# EAGLE schematic 16ChFNIRS (EAGLE 9.6.2)
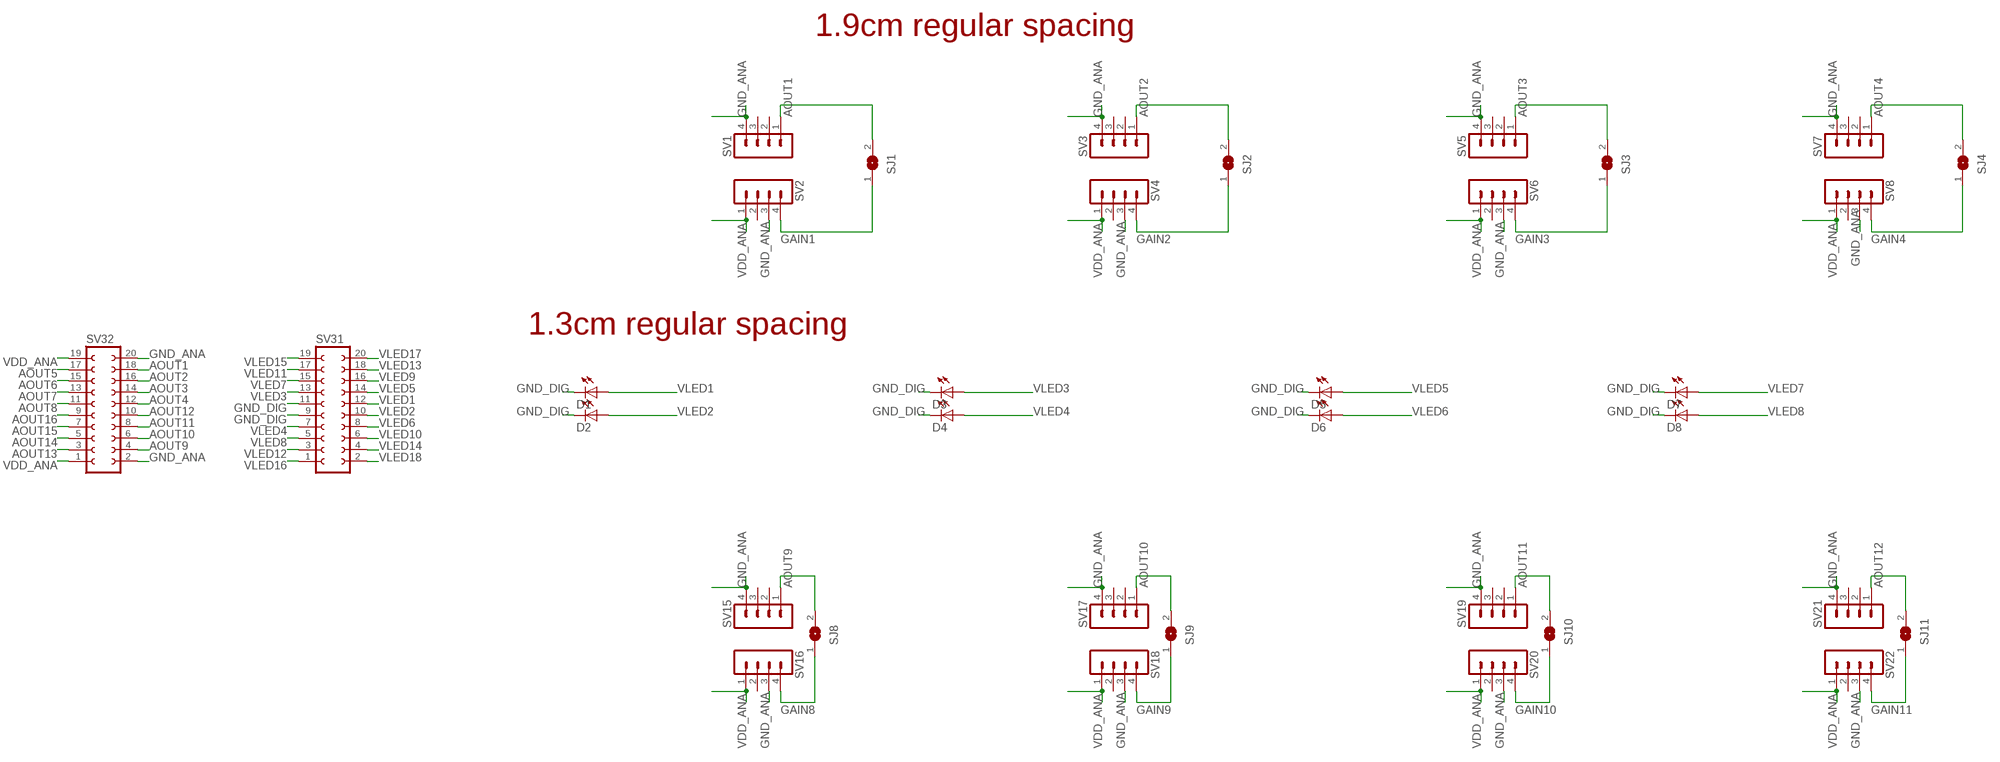
[diagram p0: schematic, sheet 1, part 1 of 2]
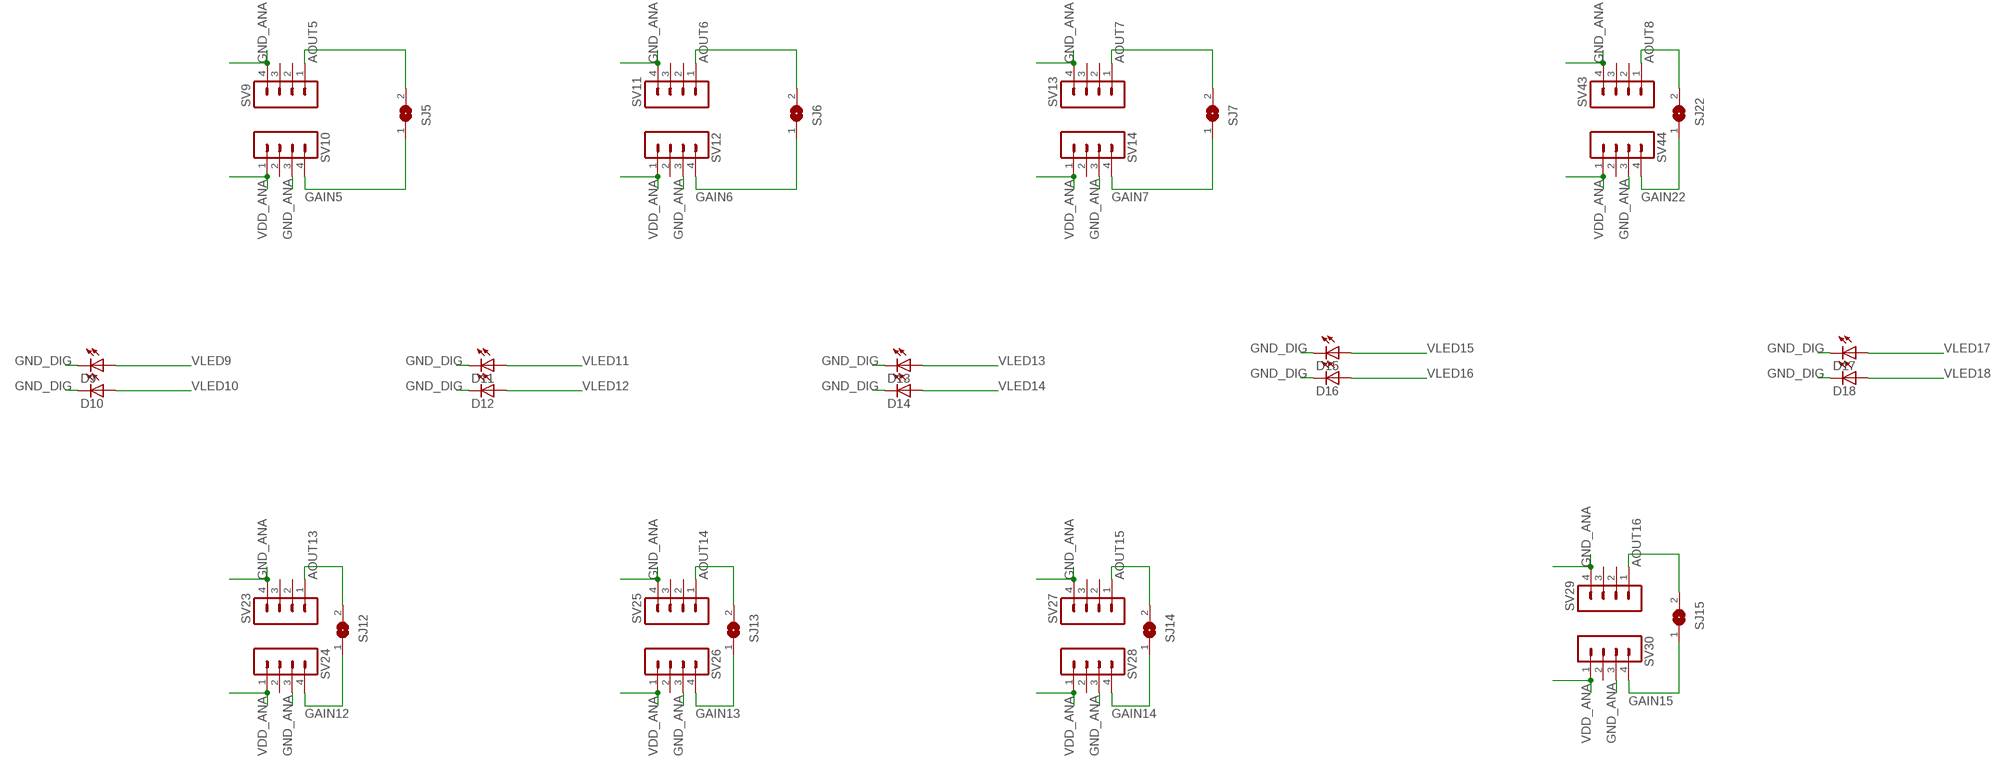
[diagram p1: schematic, sheet 1, part 2 of 2]

## Parts
D1  LED1206  [LED-1206]
D2  LED1206  [LED-1206]
D3  LED1206  [LED-1206]
D4  LED1206  [LED-1206]
D5  LED1206  [LED-1206]
D6  LED1206  [LED-1206]
D7  LED1206  [LED-1206]
D8  LED1206  [LED-1206]
D9  LED1206  [LED-1206]
D10  LED1206  [LED-1206]
D11  LED1206  [LED-1206]
D12  LED1206  [LED-1206]
D13  LED1206  [LED-1206]
D14  LED1206  [LED-1206]
D15  LED1206  [LED-1206]
D16  LED1206  [LED-1206]
D17  LED1206  [LED-1206]
D18  LED1206  [LED-1206]
SJ1  SJ  [SJ]
SJ2  SJ  [SJ]
SJ3  SJ  [SJ]
SJ4  SJ  [SJ]
SJ5  SJ  [SJ]
SJ6  SJ  [SJ]
SJ7  SJ  [SJ]
SJ8  SJ  [SJ]
SJ9  SJ  [SJ]
SJ10  SJ  [SJ]
SJ11  SJ  [SJ]
SJ12  SJ  [SJ]
SJ13  SJ  [SJ]
SJ14  SJ  [SJ]
SJ15  SJ  [SJ]
SJ22  SJ  [SJ]
SV1  MA04-1  [MA04-1]
SV2  MA04-1  [MA04-1]
SV3  MA04-1  [MA04-1]
SV4  MA04-1  [MA04-1]
SV5  MA04-1  [MA04-1]
SV6  MA04-1  [MA04-1]
SV7  MA04-1  [MA04-1]
SV8  MA04-1  [MA04-1]
SV9  MA04-1  [MA04-1]
SV10  MA04-1  [MA04-1]
SV11  MA04-1  [MA04-1]
SV12  MA04-1  [MA04-1]
SV13  MA04-1  [MA04-1]
SV14  MA04-1  [MA04-1]
SV15  MA04-1  [MA04-1]
SV16  MA04-1  [MA04-1]
SV17  MA04-1  [MA04-1]
SV18  MA04-1  [MA04-1]
SV19  MA04-1  [MA04-1]
SV20  MA04-1  [MA04-1]
SV21  MA04-1  [MA04-1]
SV22  MA04-1  [MA04-1]
SV23  MA04-1  [MA04-1]
SV24  MA04-1  [MA04-1]
SV25  MA04-1  [MA04-1]
SV26  MA04-1  [MA04-1]
SV27  MA04-1  [MA04-1]
SV28  MA04-1  [MA04-1]
SV29  MA04-1  [MA04-1]
SV30  MA04-1  [MA04-1]
SV31  FE10-2  [FE10-2]
SV32  FE10-2  [FE10-2]
SV43  MA04-1  [MA04-1]
SV44  MA04-1  [MA04-1]

## Nets
AOUT1: SJ1.2 SV1.1 SV32.18
AOUT2: SJ2.2 SV3.1 SV32.16
AOUT3: SJ3.2 SV5.1 SV32.14
AOUT4: SJ4.2 SV7.1 SV32.12
AOUT5: SJ5.2 SV9.1 SV32.17
AOUT6: SJ6.2 SV11.1 SV32.15
AOUT7: SJ7.2 SV13.1 SV32.13
AOUT8: SJ22.2 SV32.11 SV43.1
AOUT9: SJ8.2 SV15.1 SV32.4
AOUT10: SJ9.2 SV17.1 SV32.6
AOUT11: SJ10.2 SV19.1 SV32.8
AOUT12: SJ11.2 SV21.1 SV32.10
AOUT13: SJ12.2 SV23.1 SV32.3
AOUT14: SJ13.2 SV25.1 SV32.5
AOUT15: SJ14.2 SV27.1 SV32.7
AOUT16: SJ15.2 SV29.1 SV32.9
GAIN1: SJ1.1 SV2.4
GAIN2: SJ2.1 SV4.4
GAIN3: SJ3.1 SV6.4
GAIN4: SJ4.1 SV8.4
GAIN5: SJ5.1 SV10.4
GAIN6: SJ6.1 SV12.4
GAIN7: SJ7.1 SV14.4
GAIN8: SJ8.1 SV16.4
GAIN9: SJ9.1 SV18.4
GAIN10: SJ10.1 SV20.4
GAIN11: SJ11.1 SV22.4
GAIN12: SJ12.1 SV24.4
GAIN13: SJ13.1 SV26.4
GAIN14: SJ14.1 SV28.4
GAIN15: SJ15.1 SV30.4
GAIN22: SJ22.1 SV44.4
GND_ANA: SV1.4 SV2.3 SV3.4 SV4.3 SV5.4 SV6.3 SV7.4 SV8.3 SV9.4 SV10.3 SV11.4 SV12.3 SV13.4 SV14.3 SV15.4 SV16.3 SV17.4 SV18.3 SV19.4 SV20.3 SV21.4 SV22.3 SV23.4 SV24.3 SV25.4 SV26.3 SV27.4 SV28.3 SV29.4 SV30.3 SV32.2 SV32.20 SV43.4 SV44.3
GND_DIG: D1.C D2.C D3.C D4.C D5.C D6.C D7.C D8.C D9.C D10.C D11.C D12.C D13.C D14.C D15.C D16.C D17.C D18.C SV31.9 SV31.11
VDD_ANA: SV2.1 SV4.1 SV6.1 SV8.1 SV10.1 SV12.1 SV14.1 SV16.1 SV18.1 SV20.1 SV22.1 SV24.1 SV26.1 SV28.1 SV30.1 SV32.1 SV32.19 SV44.1
VLED1: D1.A SV31.12
VLED2: D2.A SV31.10
VLED3: D3.A SV31.13
VLED4: D4.A SV31.7
VLED5: D5.A SV31.14
VLED6: D6.A SV31.8
VLED7: D7.A SV31.15
VLED8: D8.A SV31.5
VLED9: D9.A SV31.16
VLED10: D10.A SV31.6
VLED11: D11.A SV31.17
VLED12: D12.A SV31.3
VLED13: D13.A SV31.18
VLED14: D14.A SV31.4
VLED15: D15.A SV31.19
VLED16: D16.A SV31.1
VLED17: D17.A SV31.20
VLED18: D18.A SV31.2
Unconnected: SV1.2 SV1.3 SV2.2 SV3.2 SV3.3 SV4.2 SV5.2 SV5.3 SV6.2 SV7.2 SV7.3 SV8.2 SV9.2 SV9.3 SV10.2 SV11.2 SV11.3 SV12.2 SV13.2 SV13.3 SV14.2 SV15.2 SV15.3 SV16.2 SV17.2 SV17.3 SV18.2 SV19.2 SV19.3 SV20.2 SV21.2 SV21.3 SV22.2 SV23.2 SV23.3 SV24.2 SV25.2 SV25.3 SV26.2 SV27.2 SV27.3 SV28.2 SV29.2 SV29.3 SV30.2 SV43.2 SV43.3 SV44.2

## Notes on the sheet
- 1.9cm regular spacing
- 1.3cm regular spacing

## Library data of the parts
D1-D18 = epic:LED: LEDs Standard schematic elements and footprints for 5mm, 3mm, 1206, and 0603 sized LEDs. 5mm - Spark Fun Electronics SKU : COM-00529 (and others)
SJ1-SJ15 SJ22 = jumper:SJ: SMD solder JUMPER
SV1-SV30 SV43 SV44 = con-lstb:MA04-1: PIN HEADER; OC_FARNELL: unknown; OC_NEWARK: unknown
SV31 SV32 = con-lsta:FE10-2: FEMALE HEADER; OC_FARNELL: unknown; OC_NEWARK: unknown